# EAGLE design OBDadapter (EAGLE 7.1.0)
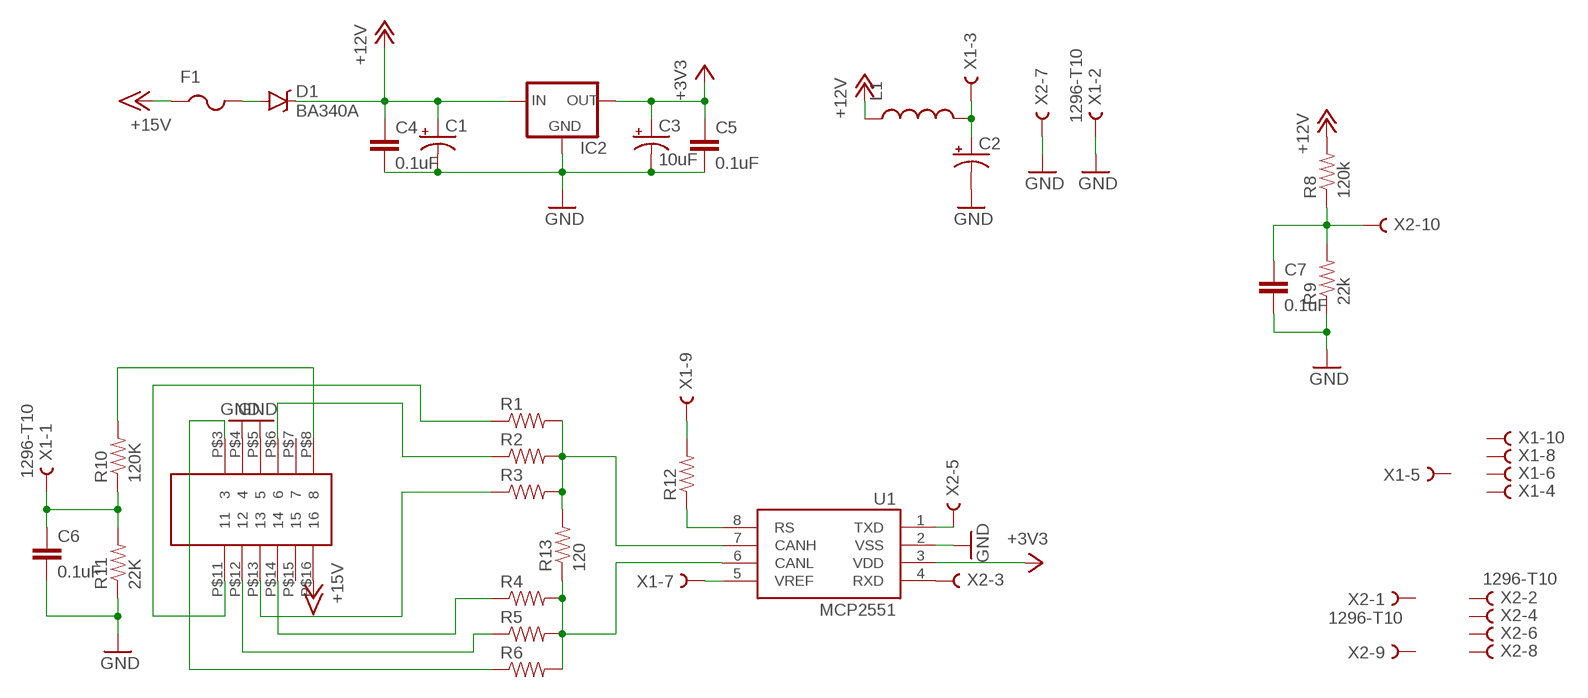
[diagram p0: schematic, sheet 1]

## Parts
C1  CAP_POL3528-KIT  [EIA3528-KIT]
C2  CAP_POL6032  [EIA6032]
C3  10uF  10UF-20V-10%(TANT)  [EIA3528]
C4  0.1uF  0.1UF-25V(+80/-20%)(0603)  [0603-CAP]
C5  0.1uF  0.1UF-25V(+80/-20%)(0603)  [0603-CAP]
C6  0.1uF  0.1UF-25V(+80/-20%)(0603)  [0603-CAP]
C7  0.1uF  0.1UF-25V(+80/-20%)(0603)  [0603-CAP]
D1  BA340A  B340A  [SMA-DIODE]
F1  PTCFUSE-1206  [R1206]
IC2  V_REG_78XXSOT89  [SOT89]
L1  INDUCTOR1210  [1210]
R1  RESISTOR0805-RES  [0805]
R2  RESISTOR0805-RES  [0805]
R3  RESISTOR0805-RES  [0805]
R4  RESISTOR0805-RES  [0805]
R5  RESISTOR0805-RES  [0805]
R6  RESISTOR0805-RES  [0805]
R8  120k  RESISTOR0805-RES  [0805]
R9  22k  RESISTOR0805-RES  [0805]
R10  120K  RESISTOR0805-RES  [0805]
R11  22K  RESISTOR0805-RES  [0805]
R12  RESISTOR0805-RES  [0805]
R13  120  RESISTOR0805-RES  [0805]
U1  MCP2551  [SO08]
U$1  OBD-4  [OBD-4]
X1  1296-T10  [1296-10]
X2  1296-T10  [1296-10]

## Nets
+3V3: C3.A(+) C5.1 IC2.1(OUT) U1.3(VDD)
+12V: C1.A(+) C4.1 D1.C IC2.3(IN) L1.1 R8.2
+15V: F1.1 U$1.P$16
GND: C1.C(-) C2.P$2(-) C3.C(-) C4.2 C5.2 C6.2 C7.2 IC2.2(GND) IC2.4(GND) R9.1 R11.1 U1.2(VSS) U$1.P$4 U$1.P$5 X1.2 X2.7
N$1: R1.1 U$1.P$11
N$2: R2.1 U$1.P$6
N$3: R5.1 U$1.P$12
N$4: R3.1 U$1.P$13
N$6: R4.1 U$1.P$14
N$7: R1.2 R2.2 R3.2 R13.2 U1.7(CANH)
N$8: R6.1 U$1.P$3
N$9: U1.1(TXD) X2.5
N$10: U1.4(RXD) X2.3
N$11: R12.2 X1.9
N$12: U1.5(VREF) X1.7
N$14: R4.2 R5.2 R6.2 R13.1 U1.6(CANL)
N$15: D1.A F1.2
N$17: R10.2 U$1.P$8
N$18: C7.1 R8.1 R9.2 X2.10
N$19: C6.1 R10.1 R11.2 X1.1
N$20: R12.1 U1.8(RS)
N$21: C2.P$1(+) L1.2 X1.3
Unconnected: U$1.P$7 U$1.P$15 X1.4 X1.5 X1.6 X1.8 X1.10 X2.1 X2.2 X2.4 X2.6 X2.8 X2.9

## Library data of the parts
C1 C2 = SparkFun-Capacitors:CAP_POL: Capacitor Polarized These are standard SMD and PTH capacitors. Normally 10uF, 47uF, and 100uF in electrolytic and tantalum varieties. Always verify the external diameter of the through hole cap, it varies with capacity, voltage, and manufacturer. The EIA devices should be standard.
C3 = SparkFun-Capacitors:10UF-20V-10%(TANT): CAP-08063; PROD_ID: CAP-08063
C4-C7 = SparkFun-Capacitors:0.1UF-25V(+80/-20%)(0603): CAP-00810 Ceramic Standard decoupling cap; PROD_ID: CAP-00810
D1 = SparkFun-DiscreteSemi:B340A: Schottky Diode 3A-40V; PROD_ID: DIO-09886
F1 = adafruit:PTCFUSE: PTC fuses, resettable thermistors
IC2 = SparkFun-PowerIC:V_REG_78XX: Voltage Regulator Standard 78xx regulator. IGO (Input Ground Output). Spark Fun Electronics SKU : COM-00107
L1 = SparkFun-Passives:INDUCTOR: Inductors Basic Inductor/Choke - 0603 and 1206. Footprints are not proven and vary greatly between part numbers. SRN6045- 33uH, 20% 1.4A SDR0403-560KL - 56uH, 10%, 500mA RMS/740mA peak
R1-R6 R8-R13 = SparkFun-Resistors:RESISTOR: Resistor Basic schematic elements and footprints for 0603, 1206, and PTH resistors.
U1 = SparkFun-DigitalIC:MCP2551: CAN transceiver; PROD_ID: IC-09907
U$1 = DueCan:OBD-4
X1 X2 = con-leotronics:1296-T10: 1.27mm SINGLE ROW FEMALE SOCKET Source: http://www.leotronics.co.uk/Conexcon/Data%20Sheets/sec.%20A/1296ing.pdf; OC_FARNELL: unknown; OC_NEWARK: unknown

## Board
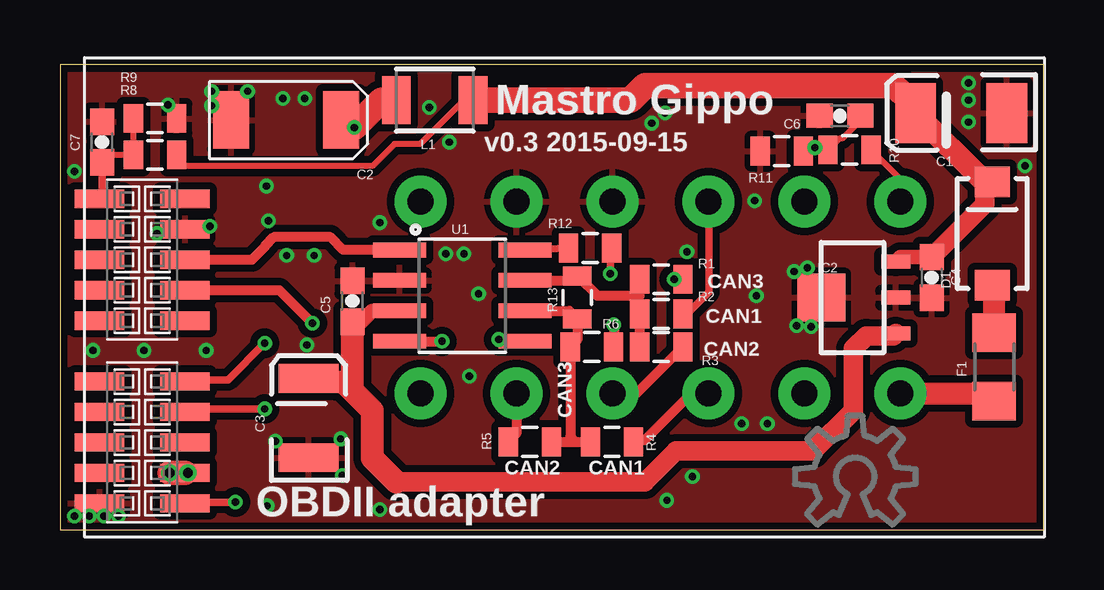
[diagram p1: board, top side]
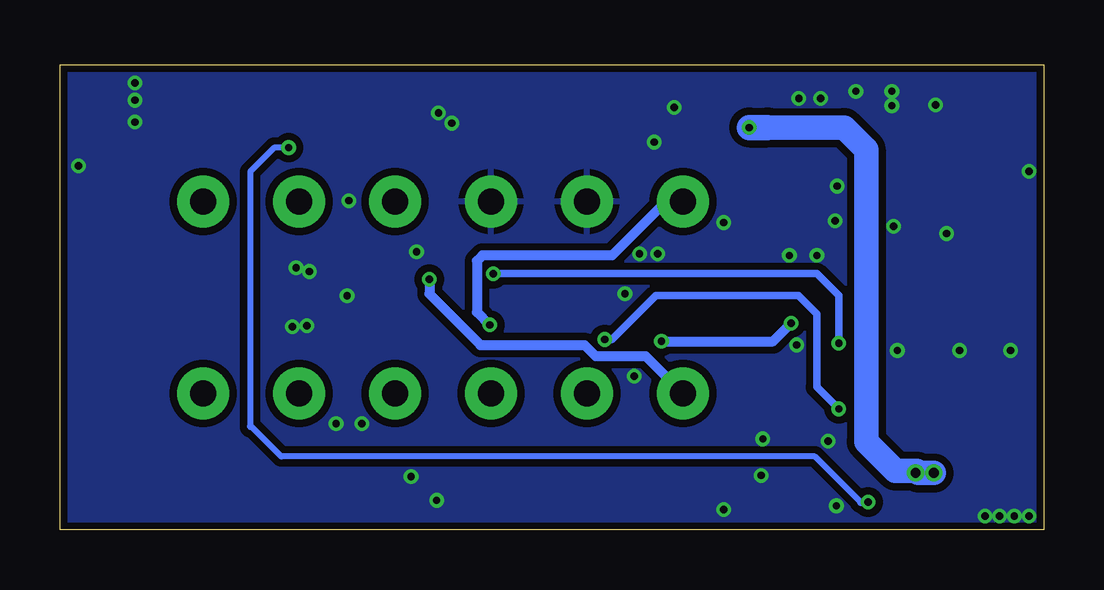
[diagram p2: board, bottom side, seen from below]

Size 41 x 19.4 mm. Coordinates in mm from the lower left corner, seen from the top.
Outline: 0,0 41,0 41,19.4 0,19.4 0,0
Copper layers (1*16): Top 0.035mm / dielectric 1.5mm / Bottom 0.035mm
Design rules "SeeedStudio_2layer_DRU_no_angle_20140221": minimum track width 6mil, minimum drill 12mil, track to track 6mil, track to pad 6mil, pad to pad 6mil, via to via 6mil, smd to smd 0mil, copper to edge 10mil, drill to drill 10mil, minimum pad ring 10mil, minimum via ring 6mil, stop-mask expansion 2mil, vias tented up to drill 100mil, thermal gap 10mil

### Footprints (pad centres in the part's own frame; a part is rotated, then mirrored left to right if it is on the bottom)
EIA3528-KIT = smd 1.7 x 2.5: A 1.9,0; C -1.9,0
EIA6032 = smd 1.5 x 2.4: P$1 -2.3,0; P$2 2.3,0
EIA3528 = smd 1.2 x 2.5: A 1.65,0; C -1.65,0
0603-CAP = smd 1.1 x 1: 1 -0.85,0; 2 0.85,0
SMA-DIODE = smd 1.27 x 1.47: A -2.15,0; C 2.15,0
R1206 = smd 1.6 x 1.803: 1 -1.422,0; 2 1.422,0
SOT89 = smd 0.58 x 1.2: 1 -1.5,-1.8; 2 0,-1.8; 3 1.5,-1.8 | smd 2 x 2: 4 0,1.3
1210 = smd 1.2 x 2: 1 -1.6,0; 2 1.6,0
0805 = smd 0.8 x 1.2: 1 -0.9,0; 2 0.9,0
SO08 = smd 0.61 x 2.21: 1 -1.905,-2.616; 2 -0.635,-2.616; 3 0.635,-2.616; 4 1.905,-2.616; 5 1.905,2.616; 6 0.635,2.616; 7 -0.635,2.616; 8 -1.905,2.616
OBD-4 = drill 1.1 pad 2.184: P$3 -6,4; P$4 -2,4; P$5 2,4; P$6 6,4; P$7 10,4; P$8 14,4; P$11 -6,-4; P$12 -2,-4; P$13 2,-4; P$14 6,-4; P$15 10,-4; P$16 14,-4
1296-10 = smd 0.76 x 2.05: 1 -2.54,-1.78; 2 -2.54,1.78; 3 -1.27,-1.78; 4 -1.27,1.78; 5 0,-1.78; 6 0,1.78; 7 1.27,-1.78; 8 1.27,1.78; 9 2.54,-1.78; 10 2.54,1.78

### Placement (x,y rotation side)
C1  37.57,17.38 180 top
C2  9.43,17.08 180 top
C3  10.36,4.65 90 top
C4  36.34,10.52 270 top
C5  12.19,9.53 90 top
C6  32.51,17.26 180 top
C7  1.75,16.16 90 top
D1  38.86,12.35 90 top
F1  38.94,6.79 90 top
IC2  33.04,9.68 90 top
L1  15.62,17.91 180 top
R1  25.07,10.44 180 top
R2  25.07,9 180 top
R3  25.07,7.62 180 top
R4  23.01,3.66 180 top
R5  19.58,3.66 0 top
R6  22.17,7.62 180 top
R8  3.96,15.63 0 top
R9  3.96,17.15 180 top
R10  32.91,15.83 0 top
R11  30.09,15.79 0 top
R12  22.1,11.74 0 top
R13  21.56,9.68 90 top
U1  16.76,9.76 270 top
U$1  21.03,9.68 0 top
U$2  [OSHWLOGO_TOL_0.2]  33.15,2.21 0 top
X1  3.43,3.64 90 top
X2  3.43,11.26 90 top

### Tracks (layer width: path | path; a pad name or v marks a point on that pad's centre or on a via)
+3V3
  Top 0.406: 14.4,9.15 U1.3
  Top 0.61: U1.3 13.01,9.12 12.42,8.54 12.26,8.54 | 12.26,8.54 12.13,8.54 C5.1 12.26,8.54
  Top 0.813: 14.02,1.99 24.38,1.99 25.68,3.28 31.39,3.28 33.07,4.96 33.07,7.55 33.6,8.08 34.74,8.08 IC2.1
  Top 0.965: 14.02,1.99 13.03,2.98 13.03,4.96 11.89,6.1 12.19,5.87 | 12.19,5.87 C5.1 | C3.A 11.86,6.15 12.19,5.87
+12V
  Top 0.254: L1.1 16.84,17.91 15.01,16.08 13.95,16.08 13.03,15.17 5.01,15.17 R8.2
  Top 0.61: C4.1 35.03,11.37 IC2.3
  Top 0.813: 38.55,14.5 38.55,13.58 C4.1
  Top 0.914: D1.C 38.55,14.5 C1.A
  Top 1.067: C1.A 35.67,17.75 34.75,18.52 24.38,18.52 23.77,17.91 L1.1
+15V
  Top 0.914: U$1.P$16 38.62,5.68 F1.1
GND  (via drill 0.3)
  other vias: 1.37,7.47 10.59,11.43 8.63,1 13.34,0.84 25.3,1.22 31.32,8.46 29.49,4.42 31.16,10.92 37.87,18.63 37.87,17.91 37.87,17 40.23,15.17 25.22,17.38 15.39,17.61 10.2,17.98 9.3,17.99 4.5,17.72 0.61,14.94 8.61,14.33 9.45,11.43 26.14,11.59 29.03,9.76 28.42,4.42 28.96,13.72 13.34,12.81 17.07,6.41 17.45,9.83 24.66,16.95 16.84,11.51 8.98,3.69 3.51,7.47 6.32,17.68 16.08,11.51 26.37,2.21 30.61,10.76 30.71,8.51 2.44,0.56 1.83,0.56 1.22,0.56 0.61,0.56 8.69,12.88 6.25,12.65 4.04,12.35 6.1,7.47 10.29,7.7 11.7,3.79 11.77,2.26 16.23,16.16 6.32,18.28 7.82,18.28
  pour Bottom (isolate 0.305): 0,-0.3 41,-0.3 41,19.7 0,19.7
  pour Top (isolate 0.305): 0,-0.3 41,-0.3 41,19.7 0,19.7
N$1  (via drill 0.3)
  Top 0.406: R1.1 v25.6,10.44
  Bottom 0.406: v25.6,10.44 25.6,9.83 23.47,7.7 19.13,7.7 18.67,7.24 16.59,7.24 U$1.P$11
N$2
  Top 0.305: R2.1 26.14,9 27.05,9.91 27.05,13.66 U$1.P$6
N$3
  Top 0.406: U$1.P$12 19.03,4.01 R5.1
N$4
  Top 0.406: U$1.P$13 24.03,5.68 R3.1
N$6
  Top 0.406: R4.1 24.38,3.74 26.36,5.72 26.99,5.72 U$1.P$14
N$7
  Top 0.254: R1.2 24.17,9.76 R2.2
  Top 0.406: U1.7 21.38,10.39 R13.2 21.58,10.58 22.4,9.76 24.17,9.76 | R3.2 R2.2
N$8  (via drill 0.3)
  Top 0.406: v23.09,8.54 R6.1
  Bottom 0.406: U$1.P$3 15.74,13.68 17.98,11.43 23.39,11.43 23.62,11.21 23.62,9.07 v23.09,8.54
N$9
  Top 0.406: X2.5 7.98,11.26 8,11.26 8.53,11.79 8.53,11.82 8.91,12.2 11.28,12.2 11.81,11.66 U1.1
N$10  (via drill 0.3)
  Top 0.406: U1.4 v15.93,7.85 | X2.3 9.14,9.99 v10.52,8.61
  Bottom 0.406: v15.93,7.85 11.28,7.85 v10.52,8.61
N$11  (via drill 0.3)
  Top 0.305: R12.2 v22.94,10.67 | v8.53,7.78 7.01,6.25 5.29,6.25 X1.9
  Bottom 0.305: v22.94,10.67 9.45,10.67 8.53,9.76 v8.53,7.78
N$12  (via drill 0.3)
  Top 0.305: U1.5 18.36,7.85 v18.29,7.93 | v8.53,5.03 5.34,5.03 X1.7
  Bottom 0.305: v18.29,7.93 17.98,7.93 16.15,9.76 10.21,9.76 9.45,9 9.45,5.95 v8.53,5.03
N$14
  Top 0.406: U1.6 21.22,9.12 R13.1 21.57,7.92 R6.2 21.27,3.88 21.49,3.66 | R5.2 21.49,3.66 | 21.49,3.66 R4.2
N$15
  Top 0.914: F1.2 38.94,10.12 D1.A
N$17
  Top 0.254: U$1.P$8 35.03,14.62 R10.2
N$18
  Top 0.254: R9.2 R8.1 1.92,15.63 C7.1
  Top 0.305: C7.1 1.75,13.9 X2.10
N$19  (via drill 0.3)
  Top 0.254: R11.2 31.97,15.79 R10.1 | C6.1 33.44,17.14 32.61,16.31 32.49,16.31 R10.1 | R10.1 31.57,15.84 v31.47,15.93
  Top 0.305: v7.32,1.15 5.26,1.15 X1.1
  Bottom 0.254: 33.07,4.35 31.77,3.05 9.53,3.05 7.62,1.15 | v31.47,15.93 32.08,15.93 33.07,14.94 33.07,4.35 | 33.07,4.27 33.07,4.35
  Bottom 0.305: 7.62,1.15 v7.32,1.15
N$20
  Top 0.305: U1.8 R12.1
N$21  (via drill 0.3, 0.41)
  Top 0.305: v5.33,2.37 X1.3
  Top 1.016: v4.57,2.37 X1.3
  Top 1.067: L1.2 13.41,17.91 v12.27,16.77 | v12.27,16.77 11.52,16.77 C2.P$1 12.22,16.82 v12.27,16.77
  Bottom 1.016: 11.51,16.77 8.31,16.77 7.39,15.85 7.39,3.66 6.17,2.44 5.29,2.44 X1.3 v4.57,2.37
  Bottom 1.067: v12.27,16.77 11.51,16.77

### Text on the board
tNames: Mastro Gippo | v0.3 2015-09-15 | CAN3 | CAN1 | CAN2 | CAN3 | CAN2 | CAN1 | OBDII adapter